# Altium schematic sheet LMR14050_mod.SchDoc
size B
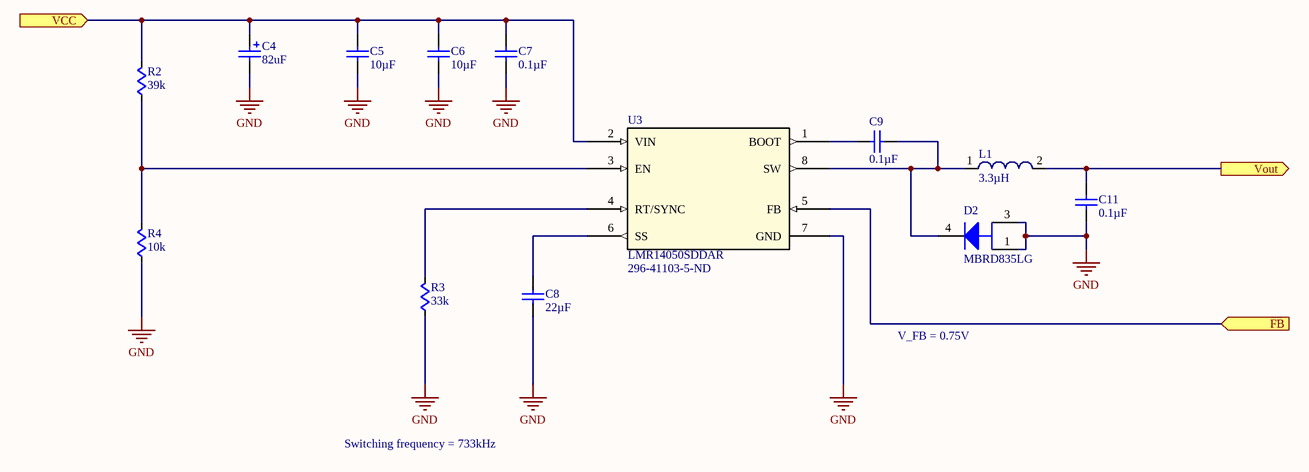
[diagram p0: LMR14050_mod.SchDoc]

## Parts
C4  value 82uF  [CAP_EEFK_D8]  (hidden comment: EEEFK1V680XP)
C5  value 10µF  [C0805]  (hidden comment: Cap)
C6  value 10µF  [C0805]  (hidden comment: Cap)
C7  value 0.1µF  [C0805]  (hidden comment: Cap)
C8  value 22µF  [C0805]  (hidden comment: Cap)
C9  value 0.1µF  [C0805]  (hidden comment: Cap)
C11  value 0.1µF  [C0805]  (hidden comment: Cap)
D2  MBRD835LG  [ONSC-DPAK-3-369C-01_V]
L1  value 3.3µH  [IHLP-2525C7]  (hidden comment: Ind)
R2  value 39k  [R0805]  (hidden comment: Res)
R3  value 33k  [R0805]  (hidden comment: Res)
R4  value 10k  [R0805]  (hidden comment: Res)
U3  LMR14050SDDAR  Supplier Part Number 1: 296-41103-5-ND  [DDA8]

## Ports
FB (in), VCC (in), Vout (out)

## Nets
GND: C4.2 C5.1 C6.1 C7.1 C8.1 C11.1 D2.1(A) D2.3(A) R3.1 R4.1 U3.7(GND)
FB: U3.5(FB) ; port FB
VCC: C4.1 C5.2 C6.2 C7.2 R2.2 U3.2(VIN) ; port VCC
Vout: C11.2 L1.2 ; port Vout
NetC8_2: C8.2 U3.6(SS)
NetC9_1: C9.1 D2.4(K) L1.1 U3.8(SW)
NetC9_2: C9.2 U3.1(BOOT)
NetR2_1: R2.1 R4.2 U3.3(EN)
NetR3_2: R3.2 U3.4(RT/SYNC)

## Notes on the sheet
- V_FB = 0.75V
- Switching frequency = 733kHz

## Library data of the parts
C4 = EEEFK1V680XP: Polarized Capacitor (Surface Mount); Vendor: Panasonic; Built_By: EMA_UL_Team; C: Copyright (C) 2015 Accelerated Designs. All rights reserved; Manufacturer_Part_Number: EEEFK1V680XP; Supplier 1: Digi-Key; Supplier Part Number 1: P18960DKR-ND
C5-C9 C11 = Cap: capacitor
D2 = CMP-1055-00169-1: SWITCHMODE(TM) Power Rectifier, 3-Pin DPAK, Pb-Free, Tube; Manufacturer: On Semiconductor; IFSM Max (A): 75; Configuration: Single; RoHS: TRUE; ComponentLink1Description: Manufacturer URL; PackageDescription: 3-Pin Flange Mount, Body 6.54 x 6.095 mm, Pitch 2.29 mm; Packing: Tube; ComponentLink2URL: http://www.onsemi.cn/pub_link/Collateral/MBRD835L-D.PDF; DatasheetVersion: Rev. 11; PackageVersion: Rev. E, 02/2014; ComponentLink3URL: http://www.onsemi.cn/pub_link/Collateral/369C.PDF; ComponentLink1URL: http://www.onsemi.com/; PackageReference: DPAK-3-369C-01; ComponentLink2Description: Datasheet; Mounting Technology: Surface Mount; ComponentLink3Description: Package Specification; PartNumber: MBRD835LG
L1 = Ind: Inductor; Supplier 1: Digi-Key; Supplier Part Number 1: 541-2580-1-ND
R2-R4 = Res: resistor
U3 = LMR14050SDDAR: dc-dc converter; Vendor: Texas Instruments; Built_By: EMA_UL_Team; C: Copyright (C) 2016 Accelerated Designs. All rights reserved; Manufacturer_Part_Number: LMR14050SDDAR; Value: Value; Type: Type; RefDes: RefDes; Supplier 1: Digi-Key